# EAGLE design ldet (EAGLE 7.4.0)
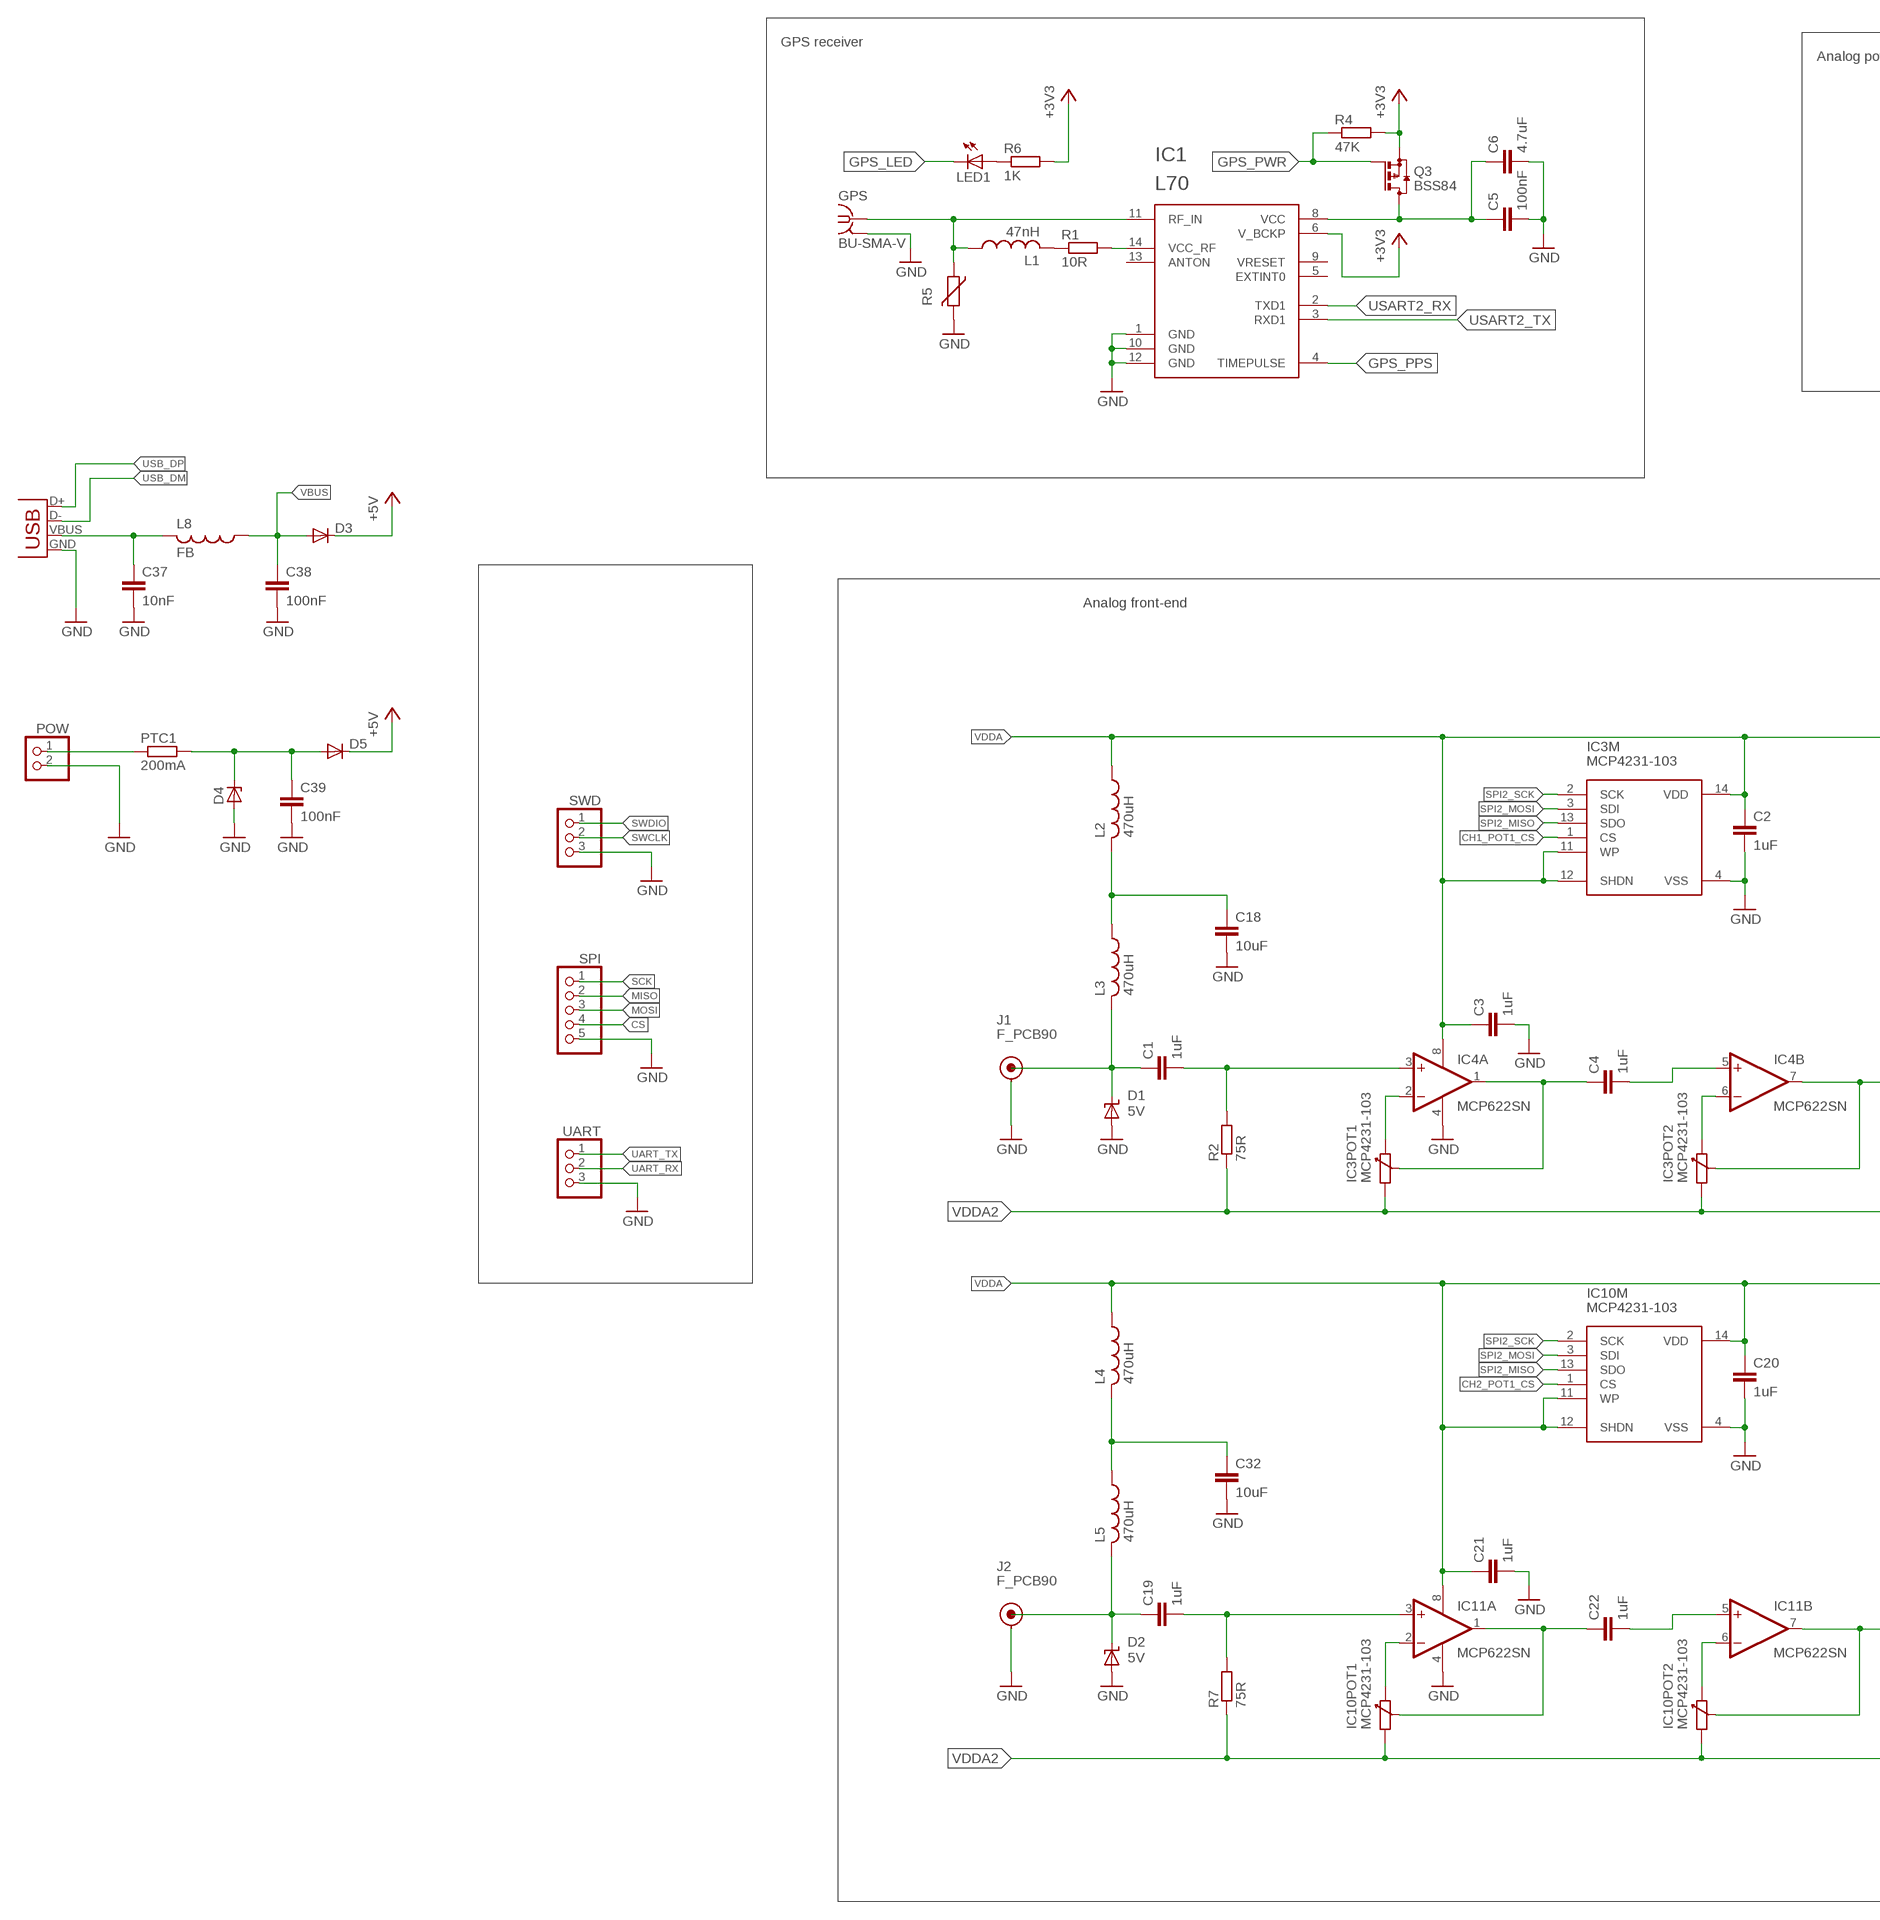
[diagram p0: schematic, sheet 1, part 1 of 2]
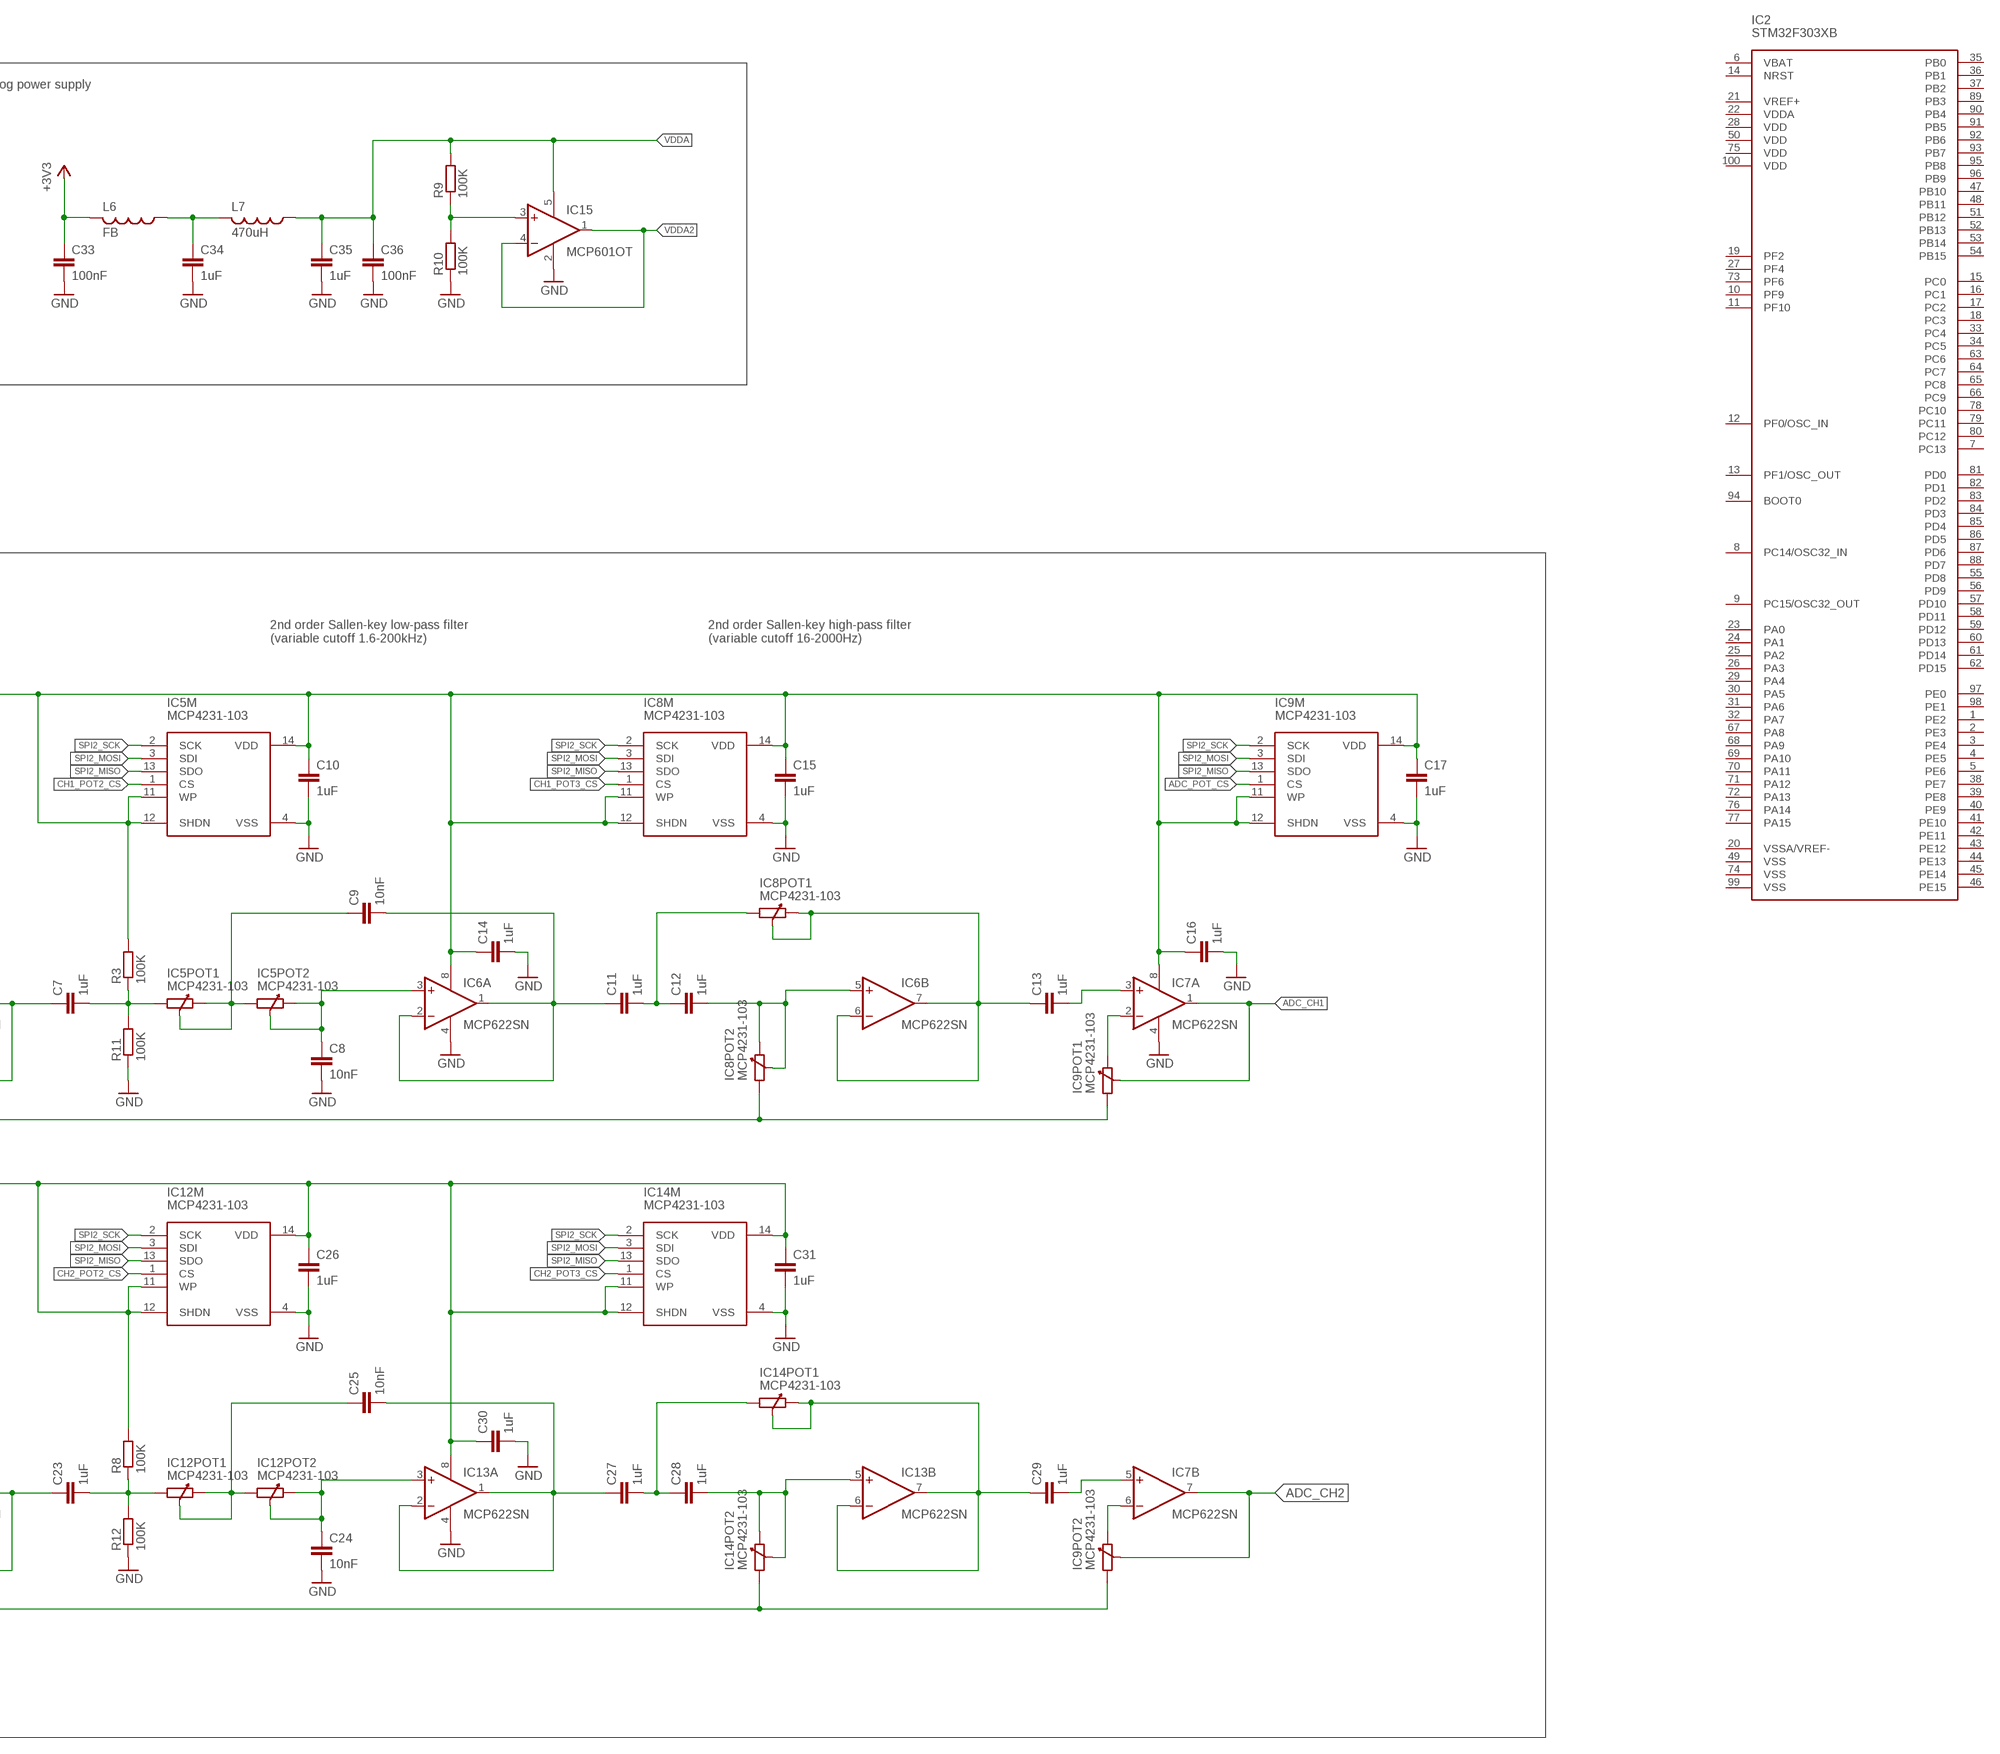
[diagram p1: schematic, sheet 1, part 2 of 2]

## Parts
C1  1uF  C-EUC0603  [C0603]
C2  1uF  C-EUC0603  [C0603]
C3  1uF  C-EUC0603  [C0603]
C4  1uF  C-EUC0603  [C0603]
C5  100nF  C-EUC0603  [C0603]
C6  4.7uF  C-EUC0805  [C0805]
C7  1uF  C-EUC0603  [C0603]
C8  10nF  C-EUC0603  [C0603]
C9  10nF  C-EUC0603  [C0603]
C10  1uF  C-EUC0603  [C0603]
C11  1uF  C-EUC0603  [C0603]
C12  1uF  C-EUC0603  [C0603]
C13  1uF  C-EUC0603  [C0603]
C14  1uF  C-EUC0603  [C0603]
C15  1uF  C-EUC0603  [C0603]
C16  1uF  C-EUC0603  [C0603]
C17  1uF  C-EUC0603  [C0603]
C18  10uF  C-EUC1206  [C1206]
C19  1uF  C-EUC0603  [C0603]
C20  1uF  C-EUC0603  [C0603]
C21  1uF  C-EUC0603  [C0603]
C22  1uF  C-EUC0603  [C0603]
C23  1uF  C-EUC0603  [C0603]
C24  10nF  C-EUC0603  [C0603]
C25  10nF  C-EUC0603  [C0603]
C26  1uF  C-EUC0603  [C0603]
C27  1uF  C-EUC0603  [C0603]
C28  1uF  C-EUC0603  [C0603]
C29  1uF  C-EUC0603  [C0603]
C30  1uF  C-EUC0603  [C0603]
C31  1uF  C-EUC0603  [C0603]
C32  10uF  C-EUC1206  [C1206]
C33  100nF  C-EUC0603  [C0603]
C34  1uF  C-EUC0603  [C0603]
C35  1uF  C-EUC0603  [C0603]
C36  100nF  C-EUC0603  [C0603]
C37  10nF  C-EUC0603  [C0603]
C38  100nF  C-EUC0603  [C0603]
C39  100nF  C-EUC0603  [C0603]
D1  5V  SUPPRESSOR-SMBJ  [SMBJ]
D2  5V  SUPPRESSOR-SMBJ  [SMBJ]
D3  DIODE-SOD123  [SOD123]
D4  ZENER-DIODESMB  [SMB]
D5  DIODE-SOD123  [SOD123]
GPS  BU-SMA-V  [BU-SMA-V]
IC1  L70  [L70]
IC2  STM32F303XB  [TQFP100]
IC3  MCP4231-103  MCP4231  [SO14]
IC4  MCP622SN  MCP602SN  [SO08]
IC5  MCP4231-103  MCP4231  [SO14]
IC6  MCP622SN  MCP602SN  [SO08]
IC7  MCP622SN  MCP602SN  [SO08]
IC8  MCP4231-103  MCP4231  [SO14]
IC9  MCP4231-103  MCP4231  [SO14]
IC10  MCP4231-103  MCP4231  [SO14]
IC11  MCP622SN  MCP602SN  [SO08]
IC12  MCP4231-103  MCP4231  [SO14]
IC13  MCP622SN  MCP602SN  [SO08]
IC14  MCP4231-103  MCP4231  [SO14]
IC15  MCP601OT  [SOT23-5]
J1  F_PCB90  [F_PCB_90]
J2  F_PCB90  [F_PCB_90]
L1  47nH  L-USL2012C  [L2012C]
L2  470uH  L-USL3225M  [L3225M]
L3  470uH  L-USL3225M  [L3225M]
L4  470uH  L-USL3225M  [L3225M]
L5  470uH  L-USL3225M  [L3225M]
L6  FB  L-USL2012C  [L2012C]
L7  470uH  L-USL3225M  [L3225M]
L8  FB  L-USL2012C  [L2012C]
LED1  LEDCHIP-LED0603  [CHIP-LED0603]
POW  PINHD-1X2  [1X02]
PTC1  200mA  R-EU_R3225  [R3225]
Q3  BSS84  [SOT23]
R1  10R  R-EU_R0603  [R0603]
R2  75R  R-EU_R0603  [R0603]
R3  100K  R-EU_R0603  [R0603]
R4  47K  R-EU_R0603  [R0603]
R5  VARISTORCN0805  [CT/CN0805]
R6  1K  R-EU_R0603  [R0603]
R7  75R  R-EU_R0603  [R0603]
R8  100K  R-EU_R0603  [R0603]
R9  100K  R-EU_R0603  [R0603]
R10  100K  R-EU_R0603  [R0603]
R11  100K  R-EU_R0603  [R0603]
R12  100K  R-EU_R0603  [R0603]
SPI  PINHD-1X5  [1X05]
SWD  PINHD-1X3  [1X03]
UART  PINHD-1X3  [1X03]
X1  USBPTH  [USB-B-PTH]

## Nets
+3V3: C33.1 IC1.6(V_BCKP) L6.2 Q3.2(S) R4.2 R6.2
+5V: D3.C D5.C
ADC_CH1: IC7.1(A:OUT) IC9.6(POT1:W)
ADC_CH2: IC7.7(B:OUT) IC9.9(POT2:W)
ADC_POT_CS: IC9.1(M:CS)
CH1_IN [coplanar waveguide 75ohm]: C1.1 D1.C J1.C(CENTER) L3.2
CH1_POT1_CS: IC3.1(M:CS)
CH1_POT2_CS: IC5.1(M:CS)
CH1_POT3_CS: IC8.1(M:CS)
CH2_IN [coplanar waveguide 75ohm]: C19.1 D2.C J2.C(CENTER) L5.2
CH2_POT1_CS: IC10.1(M:CS)
CH2_POT2_CS: IC12.1(M:CS)
CH2_POT3_CS: IC14.1(M:CS)
CS: SPI.4
GND: C2.2 C3.2 C5.2 C6.2 C8.2 C10.2 C14.2 C15.2 C16.2 C17.2 C18.2 C20.2 C21.2 C24.2 C26.2 C30.2 C31.2 C32.2 C33.2 C34.2 C35.2 C36.2 C37.2 C38.2 C39.2 D1.A D2.A D4.A GPS.2 GPS.3 GPS.4 GPS.5 IC1.1(GND) IC1.10(GND) IC1.12(GND) IC3.4(M:VSS) IC4.4(P:V-) IC5.4(M:VSS) IC6.4(P:V-) IC7.4(P:V-) IC8.4(M:VSS) IC9.4(M:VSS) IC10.4(M:VSS) IC11.4(P:V-) IC12.4(M:VSS) IC13.4(P:V-) IC14.4(M:VSS) IC15.2(V-) J1.S1(SHIELD) J1.S2(SHIELD) J1.S3(SHIELD) J1.S4(SHIELD) J2.S1(SHIELD) J2.S2(SHIELD) J2.S3(SHIELD) J2.S4(SHIELD) POW.2 R5.2 R10.1 R11.1 R12.1 SPI.5 SWD.3 UART.3 X1.GND
GPS_LED: LED1.C
GPS_PPS: IC1.4(TIMEPULSE)
GPS_PWR: Q3.1(G) R4.1
MISO: SPI.2
MOSI: SPI.3
N$1 [coplanar waveguide 75ohm]: C1.2 IC4.3(A:+IN) R2.2
N$2: IC3.5(POT1:B) IC4.2(A:-IN)
N$3: L1.2 R1.1
N$4: GPS.1 IC1.11(RF_IN) L1.1 R5.1
N$5: IC1.14(VCC_RF) R1.2
N$6 [coplanar waveguide 75ohm]: C4.1 IC3.6(POT1:W) IC4.1(A:OUT)
N$7: LED1.A R6.1
N$8: C5.1 C6.1 IC1.8(VCC) Q3.3(D)
N$9 [coplanar waveguide 75ohm]: C4.2 IC4.5(B:+IN)
N$10 [coplanar waveguide 75ohm]: C7.1 IC3.9(POT2:W) IC4.7(B:OUT)
N$11: IC3.10(POT2:B) IC4.6(B:-IN)
N$12 [coplanar waveguide 75ohm]: C7.2 IC5.7(POT1:A) R3.1 R11.2
N$13: C9.1 IC5.5(POT1:B) IC5.6(POT1:W) IC5.8(POT2:A)
N$14: C8.1 IC5.9(POT2:W) IC5.10(POT2:B) IC6.3(A:+IN)
N$15: C9.2 C11.1 IC6.1(A:OUT) IC6.2(A:-IN)
N$16: C11.2 C12.1 IC8.7(POT1:A)
N$17: C12.2 IC6.5(B:+IN) IC8.9(POT2:W) IC8.10(POT2:B)
N$18: C13.1 IC6.6(B:-IN) IC6.7(B:OUT) IC8.5(POT1:B) IC8.6(POT1:W)
N$19: IC7.2(A:-IN) IC9.5(POT1:B)
N$20: C13.2 IC7.3(A:+IN)
N$21: C18.1 L2.2 L3.1
N$22 [coplanar waveguide 75ohm]: C19.2 IC11.3(A:+IN) R7.2
N$23: IC10.5(POT1:B) IC11.2(A:-IN)
N$24: C22.1 IC10.6(POT1:W) IC11.1(A:OUT)
N$25: C22.2 IC11.5(B:+IN)
N$26: C23.1 IC10.9(POT2:W) IC11.7(B:OUT)
N$27: IC10.10(POT2:B) IC11.6(B:-IN)
N$28: C23.2 IC12.7(POT1:A) R8.1 R12.2
N$29: C25.1 IC12.5(POT1:B) IC12.6(POT1:W) IC12.8(POT2:A)
N$30: C24.1 IC12.9(POT2:W) IC12.10(POT2:B) IC13.3(A:+IN)
N$31: C25.2 C27.1 IC13.1(A:OUT) IC13.2(A:-IN)
N$32: C27.2 C28.1 IC14.7(POT1:A)
N$33: C28.2 IC13.5(B:+IN) IC14.9(POT2:W) IC14.10(POT2:B)
N$34: C29.1 IC13.6(B:-IN) IC13.7(B:OUT) IC14.5(POT1:B) IC14.6(POT1:W)
N$35: C29.2 IC7.5(B:+IN)
N$36: C32.1 L4.2 L5.1
N$37: IC7.6(B:-IN) IC9.10(POT2:B)
N$38: C34.1 L6.1 L7.2
N$39: C37.1 L8.2 X1.VBUS
N$40: IC15.3(+IN) R9.1 R10.2
N$41: POW.1 PTC1.1
N$42: C39.1 D4.C D5.A PTC1.2
SCK: SPI.1
SPI2_MISO: IC3.13(M:SDO) IC5.13(M:SDO) IC8.13(M:SDO) IC9.13(M:SDO) IC10.13(M:SDO) IC12.13(M:SDO) IC14.13(M:SDO)
SPI2_MOSI: IC3.3(M:SDI) IC5.3(M:SDI) IC8.3(M:SDI) IC9.3(M:SDI) IC10.3(M:SDI) IC12.3(M:SDI) IC14.3(M:SDI)
SPI2_SCK: IC3.2(M:SCK) IC5.2(M:SCK) IC8.2(M:SCK) IC9.2(M:SCK) IC10.2(M:SCK) IC12.2(M:SCK) IC14.2(M:SCK)
SWCLK: SWD.2
SWDIO: SWD.1
UART_RX: UART.2
UART_TX: UART.1
USART2_RX: IC1.2(TXD1)
USART2_TX: IC1.3(RXD1)
USB_DM: X1.D-
USB_DP: X1.D+
VBUS: C38.1 D3.A L8.1
VDDA: C2.1 C3.1 C10.1 C14.1 C15.1 C16.1 C17.1 C20.1 C21.1 C26.1 C30.1 C31.1 C35.1 C36.1 IC3.11(M:WP) IC3.12(M:SHDN) IC3.14(M:VDD) IC4.8(P:V+) IC5.11(M:WP) IC5.12(M:SHDN) IC5.14(M:VDD) IC6.8(P:V+) IC7.8(P:V+) IC8.11(M:WP) IC8.12(M:SHDN) IC8.14(M:VDD) IC9.11(M:WP) IC9.12(M:SHDN) IC9.14(M:VDD) IC10.11(M:WP) IC10.12(M:SHDN) IC10.14(M:VDD) IC11.8(P:V+) IC12.11(M:WP) IC12.12(M:SHDN) IC12.14(M:VDD) IC13.8(P:V+) IC14.11(M:WP) IC14.12(M:SHDN) IC14.14(M:VDD) IC15.5(V+) L2.1 L4.1 L7.1 R3.2 R8.2 R9.2
VDDA2: IC3.7(POT1:A) IC3.8(POT2:A) IC8.8(POT2:A) IC9.7(POT1:A) IC9.8(POT2:A) IC10.7(POT1:A) IC10.8(POT2:A) IC14.8(POT2:A) IC15.1(OUT) IC15.4(-IN) R2.1 R7.1
Unconnected: IC1.5(EXTINT0) IC1.9(VRESET) IC1.13(ANTON) IC2.1(PE2) IC2.2(PE3) IC2.3(PE4) IC2.4(PE5) IC2.5(PE6) IC2.6(VBAT) IC2.7(PC13) IC2.8(PC14/OSC32_IN) IC2.9(PC15/OSC32_OUT) IC2.10(PF9) IC2.11(PF10) IC2.12(PF0/OSC_IN) IC2.13(PF1/OSC_OUT) IC2.14(NRST) IC2.15(PC0) IC2.16(PC1) IC2.17(PC2) IC2.18(PC3) IC2.19(PF2) IC2.20(VSSA/VREF-) IC2.21(VREF+) IC2.22(VDDA) IC2.23(PA0) IC2.24(PA1) IC2.25(PA2) IC2.26(PA3) IC2.27(PF4) IC2.28(VDD) IC2.29(PA4) IC2.30(PA5) IC2.31(PA6) IC2.32(PA7) IC2.33(PC4) IC2.34(PC5) IC2.35(PB0) IC2.36(PB1) IC2.37(PB2) IC2.38(PE7) IC2.39(PE8) IC2.40(PE9) IC2.41(PE10) IC2.42(PE11) IC2.43(PE12) IC2.44(PE13) IC2.45(PE14) IC2.46(PE15) IC2.47(PB10) IC2.48(PB11) IC2.49(VSS) IC2.50(VDD) IC2.51(PB12) IC2.52(PB13) IC2.53(PB14) IC2.54(PB15) IC2.55(PD8) IC2.56(PD9) IC2.57(PD10) IC2.58(PD11) IC2.59(PD12) IC2.60(PD13) IC2.61(PD14) IC2.62(PD15) IC2.63(PC6) IC2.64(PC7) IC2.65(PC8) IC2.66(PC9) IC2.67(PA8) IC2.68(PA9) IC2.69(PA10) IC2.70(PA11) IC2.71(PA12) IC2.72(PA13) IC2.73(PF6) IC2.74(VSS) IC2.75(VDD) IC2.76(PA14) IC2.77(PA15) IC2.78(PC10) IC2.79(PC11) IC2.80(PC12) IC2.81(PD0) IC2.82(PD1) IC2.83(PD2) IC2.84(PD3) IC2.85(PD4) IC2.86(PD5) IC2.87(PD6) IC2.88(PD7) IC2.89(PB3) IC2.90(PB4) IC2.91(PB5) IC2.92(PB6) IC2.93(PB7) IC2.94(BOOT0) IC2.95(PB8) IC2.96(PB9) IC2.97(PE0) IC2.98(PE1) IC2.99(VSS) IC2.100(VDD)

## Notes on the sheet
- GPS receiver
- Analog power supply
- Analog front-end
- 2nd order Sallen-key low-pass filter
  (variable cutoff 1.6-200kHz)
- 2nd order Sallen-key high-pass filter
  (variable cutoff 16-2000Hz)

## Library data of the parts
C1-C39 = rcl:C-EU: CAPACITOR, European symbol
D1 D2 = diode:SUPPRESSOR-: Suppressor diode
D3 D5 = diode:DIODE-: DIODE
D4 = diode:ZENER-DIODE: Z-Diode
GPS = con-coax:BU-SMA-V: FEMALE SMA CONNECTOR Radiall distributor RS 112-3794; OC_FARNELL: unknown; OC_NEWARK: unknown
IC1 = qyx-misc:L70
IC2 = stm32f303:STM32F303XB
IC3 IC5 IC8-IC10 IC12 IC14 = microchip-digital-potentiometer:MCP4231
IC4 IC6 IC7 IC11 IC13 = linear:MCP602: Single Op Amp 2.7V to 6.0V Single Supply CMOS Source: http://ww1.microchip.com/downloads/en/DeviceDoc/21314g.pdf
IC15 = linear:MCP601: Single Op Amp 2.7V to 6.0V Single Supply CMOS Source: http://ww1.microchip.com/downloads/en/DeviceDoc/21314g.pdf
J1 J2 = con-coax:F_PCB: Amphenol F coaxial connector, PCB right angle type
L1 = rcl:L-US: INDUCTOR, American symbol
L2-L8 = rcl:L-US: INDUCTOR, American symbol; MPN: LQH32CN471K23L; OC_FARNELL: 9522255
LED1 = led:LED: LED OSRAM: - CHIPLED LG R971, LG N971, LY N971, LG Q971, LY Q971, LO R971, LY R971 LH N974, LH R974 LS Q976, LO Q976, LY Q976 LO Q996 - Hyper CHIPLED LW Q18S LB Q993, LB Q99A, LB R99A - SideLED LS A670, LO A670, LY A670, LG A670, LP A670 LB A673, LV A673, LT A673, LW A673 LH A674 LY A675 LS A676, LA A676, LO A676, LY A676, LW A676 LS A679, LY A679, LG A679 - Hyper Micro SIDELED® LS Y876, LA Y876, LO Y876, LY Y876 LT Y87S - SmartLED LW L88C, LW L88S LB L89C, LB L89S, LG L890 LS L89K, LO L89K, LY L89K LS L896, LA L896, LO L896, LY L896 - TOPLED LS T670, LO T670, LY T670, LG T670, LP T670 LSG T670, LSP T670, LSY T670, LOP T670, LYG T670 LG T671, LOG T671, LSG T671 LB T673, LV T673, LT T673, LW T673 LH T674 LS T676, LA T676, LO T676, LY T676, LB T676, LH T676, LSB T676, LW T676 LB T67C, LV T67C, LT T67C, LS T67K, LO T67K, LY T67K, LW E67C LS E67B, LA E67B, LO E67B, LY E67B, LB E67C, LV E67C, LT E67C LW T67C LS T679, LY T679, LG T679 LS T770, LO T770, LY T770, LG T770, LP T770 LB T773, LV T773, LT T773, LW T773 LH T774 LS E675, LA E675, LY E675, LS T675 LS T776, LA T776, LO T776, LY T776, LB T776 LHGB T686 LT T68C, LB T68C - Hyper Mini TOPLED® LB M676 - Mini TOPLED Santana® LG M470 LS M47K, LO M47K, LY M47K Source: http://www.osram.convergy.de LUXEON: - LUMILED® LXK2-PW12-R00, LXK2-PW12-S00, LXK2-PW14-U00, LXK2-PW14-V00 LXK2-PM12-R00, LXK2-PM12-S00, LXK2-PM14-U00 LXK2-PE12-Q00, LXK2-PE12-R00, LXK2-PE12-S00, LXK2-PE14-T00, LXK2-PE14-U00 LXK2-PB12-K00, LXK2-PB12-L00, LXK2-PB12-M00, LXK2-PB14-N00, LXK2-PB14-P00, LXK2-PB14-Q00 LXK2-PR12-L00, LXK2-PR12-M00, LXK2-PR14-Q00, LXK2-PR14-R00 LXK2-PD12-Q00, LXK2-PD12-R00, LXK2-PD12-S00 LXK2-PH12-R00, LXK2-PH12-S00 LXK2-PL12-P00, LXK2-PL12-Q00, LXK2-PL12-R00 Source: www.luxeon.com KINGBRIGHT: KA-3528ASYC Source: www.kingbright.com
POW = pinhead:PINHD-1X2: PIN HEADER
PTC1 R1-R4 R6-R12 = rcl:R-EU_: RESISTOR, European symbol
Q3 = transistor-small-signal:BSS84: P-CHANNEL MOS FET
R5 = varistor:VARISTOR: VARISTOR
SPI = pinhead:PINHD-1X5: PIN HEADER
SWD UART = pinhead:PINHD-1X3: PIN HEADER
X1 = SparkFun:USB: USB Connectors USB-B-PTH is fully proven SKU : PRT-00139 USB-miniB is fully proven SKU : PRT-00587 USB-A-PCB is untested. USB-A-H is throughly reviewed, but untested. Spark Fun Electronics SKU : PRT-00437 USB-B-SMT is throughly reviewed, but untested. Needs silkscreen touching up. USB-A-S has not been used/tested USB-MB-H has not been used/tested

## Net classes
1 coplanar waveguide 75ohm: width 0.6 mm, clearance 0.35 mm

## Board
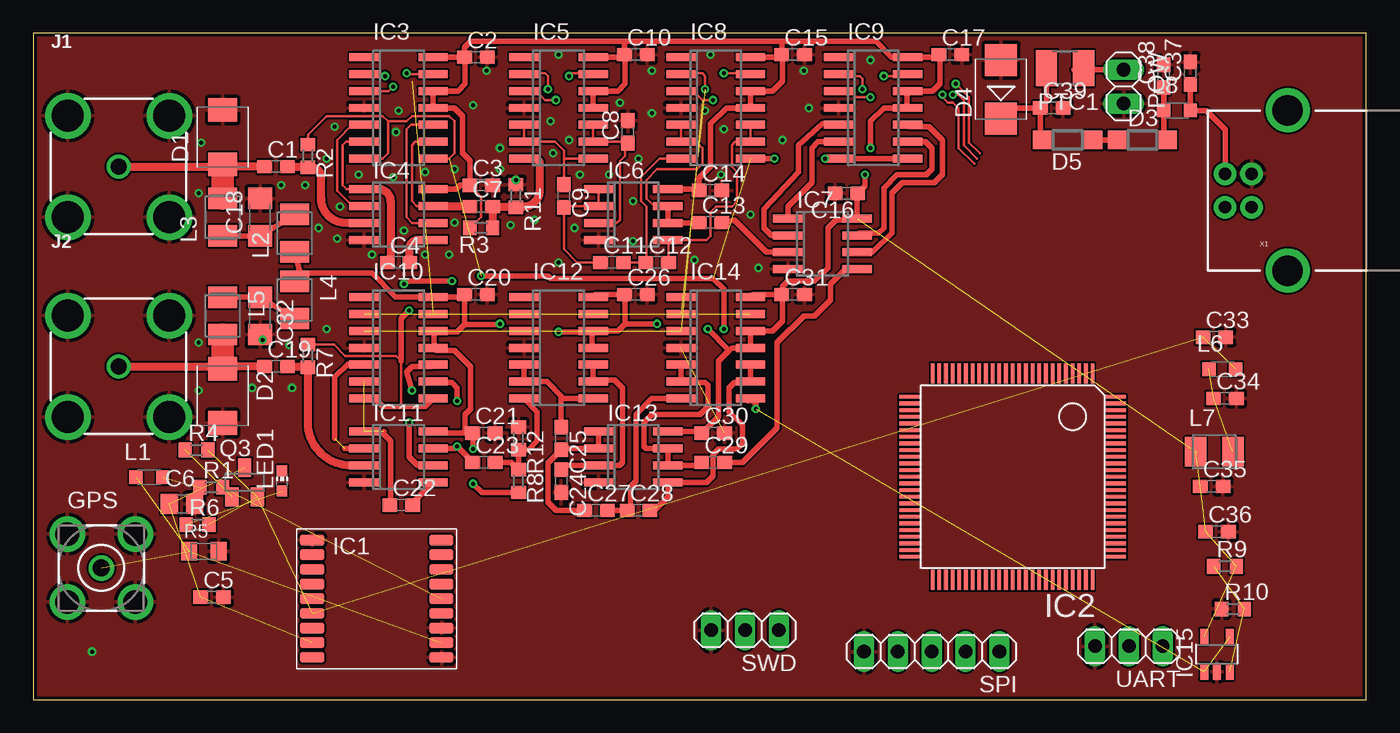
[diagram p2: board, top side]
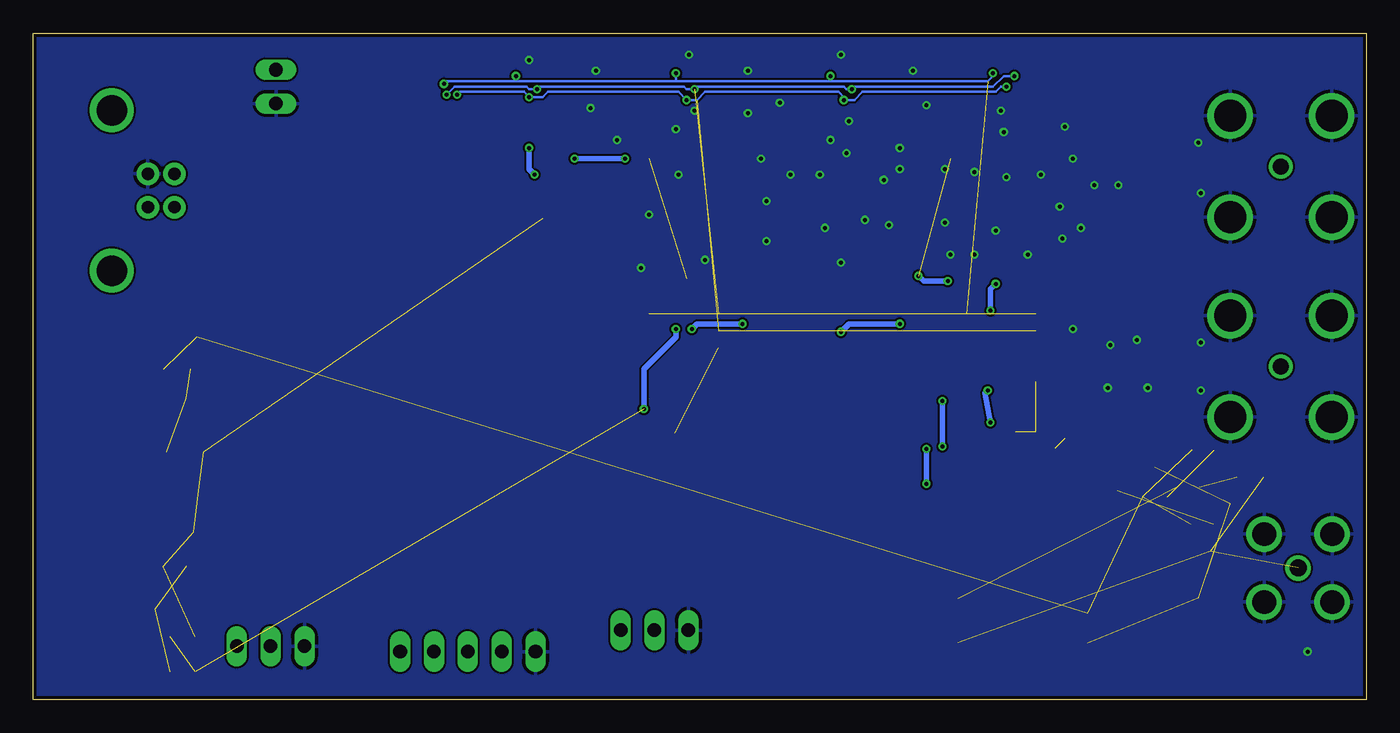
[diagram p3: board, bottom side, seen from below]

Size 100 x 50 mm. Coordinates in mm from the lower left corner, seen from the top.
Outline: 0,0 100,0 100,50 0,50 0,0
Copper layers (1*16): Top 0.035mm / dielectric 1.5mm / Bottom 0.035mm
Design rules "seeed": minimum track width 6mil, minimum drill 0.3mm, track to track 6mil, track to pad 6mil, pad to pad 6mil, via to via 6mil, smd to smd 0mil, copper to edge 10mil, drill to drill 10mil, minimum pad ring 6mil, minimum via ring 6mil, stop-mask expansion 2mil, vias tented up to drill 0.5mm, thermal gap 10mil

### Footprints (pad centres in the part's own frame; a part is rotated, then mirrored left to right if it is on the bottom)
C0603 = smd 1.1 x 1: 1 -0.85,0; 2 0.85,0
C0805 = smd 1.3 x 1.5: 1 -0.95,0; 2 0.95,0
C1206 = smd 1.6 x 1.8: 1 -1.4,0; 2 1.4,0
SMBJ = smd 1.78 x 2.16: A 2.04,0; C -2.03,0
SOD123 = smd 1.4 x 1.4: A 1.9,0; C -1.9,0
SMB = smd 2.4 x 2.4: A 2.2,0; C -2.2,0
BU-SMA-V = drill 1.27: 1 0,0 | drill 1.778: 2 -2.55,2.55; 3 2.55,2.55; 4 2.55,-2.55; 5 -2.55,-2.55
L70 = smd 1.8 x 0.8: 1 -4.85,4.4; 2 -4.85,3.3; 3 -4.85,2.2; 4 -4.85,1.1; 5 -4.85,0; 6 -4.85,-1.1; 7 -4.85,-2.2; 8 -4.85,-3.3; 9 -4.85,-4.4; 10 4.85,-4.4; 11 4.85,-3.3; 12 4.85,-2.2; 13 4.85,-1.1; 14 4.85,0; 15 4.85,1.1; 16 4.85,2.2; 17 4.85,3.3; 18 4.85,4.4
TQFP100 = smd 0.27 x 1.5: 1 -6,-7.75; 2 -5.5,-7.75; 3 -5,-7.75; 4 -4.5,-7.75; 5 -4,-7.75; 6 -3.5,-7.75; 7 -3,-7.75; 8 -2.5,-7.75; 9 -2,-7.75; 10 -1.5,-7.75; 11 -1,-7.75; 12 -0.5,-7.75; 13 0,-7.75; 14 0.5,-7.75; 15 1,-7.75; 16 1.5,-7.75; 17 2,-7.75; 18 2.5,-7.75; 19 3,-7.75; 20 3.5,-7.75; 21 4,-7.75; 22 4.5,-7.75; 23 5,-7.75; 24 5.5,-7.75; 25 6,-7.75; 51 6,7.75; 52 5.5,7.75; 53 5,7.75; 54 4.5,7.75; 55 4,7.75; 56 3.5,7.75; 57 3,7.75; 58 2.5,7.75; 59 2,7.75; 60 1.5,7.75; 61 1,7.75; 62 0.5,7.75; 63 0,7.75; 64 -0.5,7.75; 65 -1,7.75; 66 -1.5,7.75; 67 -2,7.75; 68 -2.5,7.75; 69 -3,7.75; 70 -3.5,7.75; 71 -4,7.75; 72 -4.5,7.75; 73 -5,7.75; 74 -5.5,7.75; 75 -6,7.75 | smd 1.5 x 0.27: 26 7.75,-6; 27 7.75,-5.5; 28 7.75,-5; 29 7.75,-4.5; 30 7.75,-4; 31 7.75,-3.5; 32 7.75,-3; 33 7.75,-2.5; 34 7.75,-2; 35 7.75,-1.5; 36 7.75,-1; 37 7.75,-0.5; 38 7.75,0; 39 7.75,0.5; 40 7.75,1; 41 7.75,1.5; 42 7.75,2; 43 7.75,2.5; 44 7.75,3; 45 7.75,3.5; 46 7.75,4; 47 7.75,4.5; 48 7.75,5; 49 7.75,5.5; 50 7.75,6; 76 -7.75,6; 77 -7.75,5.5; 78 -7.75,5; 79 -7.75,4.5; 80 -7.75,4; 81 -7.75,3.5; 82 -7.75,3; 83 -7.75,2.5; 84 -7.75,2; 85 -7.75,1.5; 86 -7.75,1; 87 -7.75,0.5; 88 -7.75,0; 89 -7.75,-0.5; 90 -7.75,-1; 91 -7.75,-1.5; 92 -7.75,-2; 93 -7.75,-2.5; 94 -7.75,-3; 95 -7.75,-3.5; 96 -7.75,-4; 97 -7.75,-4.5; 98 -7.75,-5; 99 -7.75,-5.5; 100 -7.75,-6
SO14 = smd 0.6 x 2.2: 1 -3.81,-2.6; 2 -2.54,-2.6; 3 -1.27,-2.6; 4 0,-2.6; 5 1.27,-2.6; 6 2.54,-2.6; 7 3.81,-2.6; 8 3.81,2.6; 9 2.54,2.6; 10 1.27,2.6; 11 0,2.6; 12 -1.27,2.6; 13 -2.54,2.6; 14 -3.81,2.6
SO08 = smd 0.6 x 2.2: 1 -1.905,-2.6; 2 -0.635,-2.6; 3 0.635,-2.6; 4 1.905,-2.6; 5 1.905,2.6; 6 0.635,2.6; 7 -0.635,2.6; 8 -1.905,2.6
SOT23-5 = smd 0.6 x 1.2: 1 -0.95,-1.306; 2 0,-1.306; 3 0.95,-1.306; 4 0.95,1.306; 5 -0.95,1.306
F_PCB_90 = drill 1.2: C 0,0 | drill 2.4: S1 -3.81,-3.81; S2 3.81,-3.81; S3 3.81,3.81; S4 -3.81,3.81
L2012C = smd 1 x 1: 1 -1,0; 2 1,0
L3225M = smd 1.6 x 2.2: 1 -1.4,0; 2 1.4,0
CHIP-LED0603 = smd 0.8 x 0.8: A 0,-0.75; C 0,0.75
1X02 = drill 1.016 long: 1 -1.27,0; 2 1.27,0
R3225 = smd 1.6 x 2.7: 1 -1.4,0; 2 1.4,0
SOT23 = smd 1 x 1.4: 1 -0.95,-1.1; 2 0.95,-1.1; 3 0,1.1
R0603 = smd 1 x 1.1: 1 -0.85,0; 2 0.85,0
CT/CN0805 = smd 1.2 x 1.4: 1 -1.1,0; 2 1.1,0
1X05 = drill 1.016 long: 1 -5.08,0; 2 -2.54,0; 3 0,0; 4 2.54,0; 5 5.08,0
1X03 = drill 1.016 long: 1 -2.54,0; 2 0,0; 3 2.54,0
USB-B-PTH = drill 0.914 pad 1.676: D+ 0,1.25; D- 1.981,1.25; GND 0,-1.25; VBUS 1.981,-1.25 | drill 2.286: S1 -2.718,-6.02; S2 -2.718,6.02

### Placement (x,y rotation side)
C1  18.2,40 0 top
C2  33.2,48.2 0 top
C3  33.6,38.6 0 top
C4  27.4,32.8 0 top
C5  13.4,7.68 0 top
C6  11.16,14.68 0 top
C7  33.6,37 0 top
C8  44.6,42.6 90 top
C9  39.8,37.8 270 top
C10  45.2,48.4 0 top
C11  43.4,32.8 0 top
C12  46.8,32.8 0 top
C13  50.8,35.8 0 top
C14  50.8,38.2 0 top
C15  57,48.4 0 top
C16  61,38 180 top
C17  68.8,48.4 0 top
C18  17,36.2 90 top
C19  18.2,25 0 top
C20  33.2,30.4 0 top
C21  33.8,20 0 top
C22  27.6,14.6 0 top
C23  33.8,17.8 0 top
C24  39.6,16.4 270 top
C25  39.6,19.6 270 top
C26  45.2,30.4 0 top
C27  42.2,14.2 0 top
C28  45.4,14.2 0 top
C29  51,17.8 0 top
C30  51,20 0 top
C31  57,30.4 0 top
C32  17,28.8 270 top
C33  88.6,27.2 0 top
C34  89.4,22.6 0 top
C35  88.4,16 0 top
C36  88.8,12.6 0 top
C37  86.8,47 90 top
C38  84.8,46.8 90 top
C39  76.4,44.4 0 top
D1  14.2,42.2 90 top
D2  14.2,22.8 270 top
D3  83.2,42 0 top
D4  72.6,45.8 90 top
D5  77.6,42 180 top
GPS  5.1,9.87 0 top
IC1  25.77,7.57 0 top
IC2  73.47,16.72 180 top
IC3  27.4,44.4 270 top
IC4  27.4,36.4 270 top
IC5  39.4,44.4 270 top
IC6  45,36.4 270 top
IC7  59.2,34.2 270 top
IC8  51.2,44.4 270 top
IC9  63,44.4 270 top
IC10  27.4,26.4 270 top
IC11  27.4,18.2 270 top
IC12  39.4,26.4 270 top
IC13  45,18.2 270 top
IC14  51.2,26.4 270 top
IC15  88.8,3.4 0 top
J1  6.4,40 0 top
J2  6.4,25 0 top
L1  8.71,16.68 0 top
L2  19.6,35 90 top
L3  14.2,36.2 90 top
L4  19.6,30 270 top
L5  14.2,28.8 270 top
L6  89.2,24.8 0 top
L7  88.6,18.6 0 top
L8  85.8,44.2 0 top
LED1  18.66,16.41 0 top
POW  81.8,46 270 top
PTC1  77.4,47.4 180 top
Q3  15.86,16.31 0 top
R1  13.36,15.93 0 top
R2  20.6,40.8 270 top
R3  33.6,35.4 180 top
R4  12.24,18.73 0 top
R5  12.8,11.13 0 top
R6  12.32,13.13 0 top
R7  20.6,25.8 270 top
R8  36.4,16.4 270 top
R9  89.4,10 0 top
R10  90,6.8 0 top
R11  36.2,37.8 270 top
R12  36.4,19.6 270 top
SPI  67.4,3.6 180 top
SWD  53.4,5.2 180 top
UART  82.2,4 180 top
X1  91.4,38.2 180 top

### Tracks (layer width: path | path; a pad name or v marks a point on that pad's centre or on a via)
+3V3  (5 unrouted)
+5V
  Top 0.406: D5.C D3.C
ADC_CH1
  Top 0.406: IC9.6 58.86,41.86 58.4,41.4 58.4,38.8 56.6,37 IC7.1
ADC_CH2
  Top 0.406: IC9.9 66.94,41.86 67.4,41.4 67.4,39.8 67,39.4 64.8,39.4 63.8,38.4 63.8,35.4 63.4,35 61.97,35 IC7.7
CH1_IN
  Top 0.406: 14.57,40 D1.C 14.03,39.8 14,39.8
  Top 0.61: J1.C 14.23,40 | C1.1 14.57,40
  Top 1.676: 14.23,40 D1.C L3.2
CH2_IN
  Top 0.406: 14.57,25 D2.C
  Top 0.61: C19.1 14.57,25 | J2.C 14.23,25
  Top 1.676: 14.23,25 D2.C L5.2
GND  (via drill 0.3)  (1 unrouted)
  other vias: 4.4,3.6 12.6,41.8 12.4,38 12.4,26.8 12.4,23.2 18.6,38.6 20.4,38.6 17.2,27 16.4,23.4 19.4,23.4 19.2,26.6 22,27.8 21.4,35.4 22.8,34.6 25.4,33.4 27.8,35.2 29.4,33.4 31.2,33.4 27,39.2 24.4,39.4 23,37 22.6,43 22,40.6 31.6,35.8 35.8,35.6 37.6,36 36.2,39 35,39.8 35,41.4 27.2,42.6 27.4,44.2 29.4,39.6 31.6,39.8 33,44.6 34,47.2 39,41 41,39.4 43.2,39.4 40.2,42 38.8,43.4 45,34.4 40.6,35.4 39.4,32.8 45,37.4 45.4,40.6 46.4,44 44,44.8 46.4,47.2 50.8,48.4 50.4,44.2 51.6,39.4 51.8,42.8 57.8,47.2 39.4,48.4 62.8,48 58.2,44.4 56.2,42 53.8,36.4 49.6,33 54.4,32.4
  pour Top (rank 2): 0,0 100,0 100,50 0,50
  pour Bottom (rank 2): 0,0 100,0 100,50 0,50
GPS_PWR  (1 unrouted)
N$1
  Top 0.2: 20.55,40 R2.2 20.85,39.95
  Top 0.61: C1.2 20.55,40 | 20.85,39.95 arc-90 21.6,39.2 21.6,37.6 arc90 23.43,35.77 IC4.3
N$2
  Top 0.2: IC4.2 23.96,37.03 22.8,38.2 22.8,42 23.93,43.13 IC3.5
N$3  (1 unrouted)
N$4  (3 unrouted)
N$5  (1 unrouted)
N$6
  Top 0.2: IC4.1 23.5,38.3 23.2,38.6 23.2,41.6 23.46,41.86 IC3.6
  Top 0.61: IC4.1 25.89,38.3 arc-90 26.8,37.4 26.8,33.05 arc-90 C4.1
N$7  (1 unrouted)
N$8  (3 unrouted)
N$9
  Top 0.61: IC4.5 28.89,34.49 arc90 28.2,33.8 28.2,32.85 arc90 C4.2
N$10
  Top 0.2: IC3.9 28.66,41.86 28.4,41.6 28.4,37.4 28.77,37.03 IC4.7
  Top 0.61: IC4.7 32.72,37.03 C7.1
N$11
  Top 0.2: IC4.6 28.43,35.77 28,36.2 28,42.8 28.33,43.13 IC3.10
N$12
  Top 0.61: 36.15,37 C7.2 R3.1 | 36.15,37 R11.2 | 36.15,37 36.8,37 arc90 38,38.2 38,40.2 arc90 37.6,40.6 IC5.7 arc90 IC5.7
N$13
  Top 0.2: IC5.5 IC5.6 39.14,41.86 39.8,41.2 | 39.8,41.2 C9.1 | IC5.8 39.81,40.59 39.8,41.2
N$14
  Top 0.2: IC5.10 IC5.9 44.49,41.86 C8.1 44.4,41.55 44.4,40.8 44,40.4 44,36 43.77,35.77 IC6.3
N$15
  Top 0.2: C11.1 40.8,32.8 39.8,33.8 C9.2 39.88,37.03 IC6.2 IC6.1
N$16
  Top 0.2: IC8.7 46.99,40.59 45.6,39.2 45.6,37.4 46,37 46,32.85 C12.1 C11.2
N$17
  Top 0.2: C12.2 47.65,34.45 IC6.5 50.49,34.49 50.8,34.8 50.8,36.6 51.2,37 52.4,37 52.8,37.4 52.8,39.6 52.4,40 52.4,41.6 52.66,41.86 IC8.9 IC8.10
N$18
  Top 0.2: IC6.7 46.56,37.03 46,37.6 46,39 46.8,39.8 49.8,39.8 50.2,40.2 50.2,41.4 49.74,41.86 IC8.6 IC8.5
  Top 0.406: IC6.7 IC6.6 49.72,35.77 C13.1
N$19
  Top 0.406: IC7.2 55.37,34.84 54.8,35.4 54.8,36.8 57.4,39.6 57.4,41.6 59.2,43.2 60.33,43.2 IC9.5
N$20
  Top 0.406: C13.2 52.6,36 55,33.6 56.56,33.6 IC7.3
N$21
  Top 0.406: L2.2 C18.1 L3.1
N$22
  Top 0.406: 19,24.95 C19.2
  Top 0.61: 19,24.95 R7.2 20.6,20.8 arc90 23.84,17.57 IC11.3
N$23  (1 unrouted)
  Top 0.406: IC11.2 23.36,18.84 | 22.6,19.6 22.6,24.2 23.6,25.2 24.73,25.2 IC10.5
N$24  (2 unrouted)
  Top 0.406: 26.3,20.11 26.3,19.89 26.8,19.4 26.8,14.65 C22.1
N$25
  Top 0.406: C22.2 28.45,14.74 IC11.5
N$26  (via drill 0.3)
  Top 0.406: IC11.7 31.64,18.84 v31.8,19 32.95,17.85 C23.1 | v31.8,22.4 31.8,23.4 31.4,23.8 30.06,23.8 IC10.9
  Bottom 0.406: v31.8,19 v31.8,22.4
N$27  (via drill 0.3)
  Top 0.406: IC11.6 28.84,17.57 28.2,18.2 v28.2,20.8 | v28.4,23.2 28,24.6 28.4,25 29.87,25 IC10.10
  Bottom 0.406: v28.2,20.8 28.6,23 v28.4,23.2
N$28
  Top 0.406: IC12.7 37.8,21.59 37.8,19.4 37.15,18.75 R12.2 R8.1 35.85,17.8 C23.2
N$29
  Top 0.406: IC12.5 IC12.6 38.54,23.86 39.6,22.8 39.6,22.6 | 39.6,22.6 C25.1 | IC12.8 39.61,22.59 39.6,22.6
N$30
  Top 0.406: C24.1 39.91,17.57 IC13.3 43.97,17.57 44.2,17.8 44.2,23.4 43.6,24 42.14,24 IC12.9 IC12.10
N$31
  Top 0.406: IC13.1 IC13.2 39.69,18.84 C25.2 38.6,17.75 38.6,14.8 39.2,14.2 C27.1
N$32
  Top 0.406: IC14.7 46.39,22.59 45.2,21.4 45.2,16.4 44.8,16 44.8,14.45 C28.1 C27.2
N$33
  Top 0.406: C28.2 46.6,14.2 47.6,15.2 IC13.5 50.49,16.3 51,16.8 51,18.4 51.4,18.8 52.8,18.8 53.2,19.2 53.2,20.6 52.2,21.6 52.2,23.4 52.6,23.8 53.74,23.8 IC14.9 IC14.10
N$34
  Top 0.406: IC14.5 IC14.6 48.66,23.8 50.4,23.8 50.6,23.6 50.6,22 50,21.4 46.4,21.4 45.8,20.8 45.8,19 45.97,18.84 IC13.7 IC13.6 49.91,17.57 C29.1
N$35
  Top 0.406: C29.2 53.2,17.8 55.8,20.4 55.8,26.8 57.8,28.8 58.6,28.8 59.8,30 59.8,31.2 60.8,32.2 61.7,32.2 IC7.5
N$36
  Top 0.406: L5.1 C32.1 L4.2
N$37
  Top 0.406: IC7.6 62.97,33.56 64.4,35 64.4,38 65.2,38.8 67.6,38.8 68.2,39.4 68.2,42 67.2,43 65.73,43 IC9.10
N$38  (2 unrouted)
N$39
  Top 0.406: X1.VBUS 89.42,42.78 88,44.2 L8.2 C37.1
N$40  (2 unrouted)
N$41
  Top 0.406: POW.1 78.07,47.27 PTC1.1
N$42
  Top 0.406: 75.2,42 D5.A 75.55,42.15 C39.1 | PTC1.2 76,44.85 C39.1 | C39.1 73.4,44.4 D4.C
SPI2_MISO  (via drill 0.3)  (3 unrouted)
  Top 0.2: IC3.13 28.06,46.94 v28,47 | v40.2,46.8 40.4,47 41.94,47 IC5.13 | v69.2,46.2 70.2,45.2 70.2,41.8 71,41 | v51.8,47 53.74,47 IC8.13 | v63.8,46.8 65.46,46.8 IC9.13
  Bottom 0.2: v28,47 28,46.8 28.4,46.4 40.2,46.4 | 40.2,46.4 v40.2,46.8 | 40.2,46.4 51.8,46.4 | 51.8,46.4 v51.8,47 | 51.8,46.4 63.8,46.4 | 63.8,46.4 v63.8,46.8 | 63.8,46.4 69,46.4 v69.2,46.2
SPI2_MOSI  (via drill 0.3)  (3 unrouted)
  Top 0.2: IC3.3 26.67,45.67 v27,46 | v39.2,45 38.4,45 37.8,45.6 36.87,45.6 IC5.3 | v51,45 50.2,45 49.6,45.6 48.67,45.6 IC8.3 | v62.8,45.2 61.8,45.2 61.4,45.6 60.47,45.6 IC9.3 | v68.2,45.4 68.2,45.2 68.6,44.8 69,44.8 69.4,44.4 69.4,41.4 70.6,40.2
  Bottom 0.2: v27,46 27.4,46 27.8,45.6 37.8,45.6 38.4,45 v39.2,45 39.2,45.2 39.6,45.6 49.6,45.6 50.2,45 v51,45 51.6,45.6 61.4,45.6 61.8,45.2 v62.8,45.2 63.2,45.6 68,45.6 v68.2,45.4
SPI2_SCK  (via drill 0.3)  (3 unrouted)
  Top 0.2: IC3.2 26.26,46.94 v26.4,46.8 | v38.6,45.8 38.6,46.8 38.4,47 36.86,47 IC5.2 | v50.4,45.8 50.4,46.8 50.2,47 48.66,47 IC8.2 | v62.2,45.8 62.2,46.6 62,46.8 60.54,46.8 IC9.2 | v69,45.4 69.4,45.4 69.8,45 69.8,41.6 70.8,40.6
  Bottom 0.2: v26.4,46.8 27.2,46.8 28,46 38.4,46 v38.6,45.8 39,45.8 39.2,46 50.2,46 v50.4,45.8 51,45.8 51.2,46 62,46 v62.2,45.8 62.8,45.8 63,46 68.4,46 v69,45.4
VBUS
  Top 0.406: C38.1 L8.1 84.8,42.3 D3.A
VDDA  (via drill 0.3)  (5 unrouted)
  Top 0.2: R3.2 32.8,35.4 33.6,36.2 33.6,37.75 C3.1
  Top 0.406: L2.1 20,32 | 20,32 L4.1 | IC3.14 C2.1 | IC5.11 IC5.12 | 41.93,45.6 IC5.12 | 53.73,45.6 IC8.12 | v62.8,41.4 62.8,43.4 63.8,44.4 IC9.11 65.53,44.47 65.53,45.6 IC9.12 67.47,45.67 68,46.2 68,48.35 C17.1 67.76,48.21 IC9.14 64.39,48.21 63.2,49.4 56.2,49.4 | v62.4,39.4 62.4,38.55 C16.1 61.8,37.95 IC7.8 61.7,36 60.2,36 59.6,35.4 59.6,32.4 58.6,31.4 56.6,31.4 56.2,31 56.2,30.35 | 32.35,28.15 C20.1 32.16,30.21 IC10.14 27.19,30.21 25.4,32 20,32 | 32.35,28.15 31.8,27.6 30.07,27.6 | 30.07,27.6 IC10.12 | 30.07,27.6 30.07,26.47 IC10.11 30.2,26.2 31.6,26.2 32.8,25 32.8,21.8 32.4,21.4 32.4,20 | 32.35,28.15 34.95,28.15 v35,28.2 | v39.4,27.6 41.93,27.6 | 41.93,27.6 IC12.12 43.87,27.67 44.4,28.2 | 41.93,27.6 41.93,26.47 IC12.11 | 44.4,28.2 44.4,30.35 C26.1 42.19,30.4 IC12.14 | 32.4,20 C21.1 33,19.95 v33,18.8 | 32.4,20 30.11,20 IC11.8 | R8.2 33.65,15.55 v33,16.2 | IC13.8 50.05,20.11 C30.1 51.4,21.25 51.4,25.4 52.2,26.2 | 52.2,26.2 52.4,26.4 IC14.11 IC14.12 55.47,27.67 56.2,28.4 56.2,30.35 | 44.4,28.2 v46.8,28.2 | v50.6,27.8 52.2,26.2 | 56.2,30.35 C31.1 53.99,30.4 IC14.14 | C2.1 32.35,48.95 32.8,49.4 44.2,49.4 | 44.2,49.4 56.2,49.4 | C15.1 56.15,49.35 56.2,49.4 | C10.1 44.35,49.25 44.2,49.4 | IC5.12 43.87,45.67 44.4,46.2 44.4,48.35 C10.1 | IC5.14 44.16,48.21 C10.1 | IC8.14 55.96,48.21 C15.1 | IC8.12 55.47,45.67 56.2,46.4 56.2,48.35 C15.1 | C2.1 32.4,48.15 32.4,46.2 31.87,45.67 IC3.12 IC3.11 31.6,44.4 32.2,43.8 32.2,41 32.75,40.45 C3.1 32,38.6 31.7,38.3 IC4.8 | IC6.8 49.84,38.3 C14.1 49.95,39.15 50.8,40 50.8,43.2 52,44.4 IC8.11 IC8.12
  Bottom 0.406: v62.8,41.4 62.8,39.8 v62.4,39.4 | v35,28.2 38.8,28.2 v39.4,27.6 | v33,16.2 v33,18.8 | v46.8,28.2 50.2,28.2 v50.6,27.8
VDDA2  (via drill 0.3)  (5 unrouted)
  Top 0.2: R7.1 22.55,26.65 23.4,25.8 27.2,25.8 27.6,25.4 27.6,22.2 27.8,22 | R2.1 20.6,42.4 22,43.8 26.2,43.8 26.6,43.4 | 26.6,43.4 26.6,41 26.19,40.59 IC3.7 | 26.6,43.4 28,43.4 28.4,43.8 31.2,43.8 31.6,43.4 31.6,41 31.19,40.59 IC3.8
  Top 0.406: IC9.8 IC9.7 v59.41,40.59 v59.4,40.6 | v55.6,40.6 IC8.8 | IC10.7 25.61,22.59 26.2,22 27.8,22 29.41,22 IC10.8 29.61,22.59 29.6,22.6 | 27.6,25.4 27.6,28.6 v28.2,29.2 | v27.8,31.2 27.8,31.4 v31.4,31.4 | v33.6,31.8 38.6,31.8 38.8,31.6 51,31.6 51.8,30.8 v51.8,27.8 | v54.2,21.8 54.2,22.2 IC14.8 | 54,22.6 IC14.8 | IC14.8 53.6,22.4
  Bottom 0.406: v59.4,40.6 v55.6,40.6 | v28.2,29.2 28.2,30.8 v27.8,31.2 | v31.4,31.4 33.2,31.4 v33.6,31.8 | v51.8,27.8 51.8,27.2 54.2,24.8 v54.2,21.8